# EAGLE design slush_cap_board_rev_c (EAGLE 8.5.0)
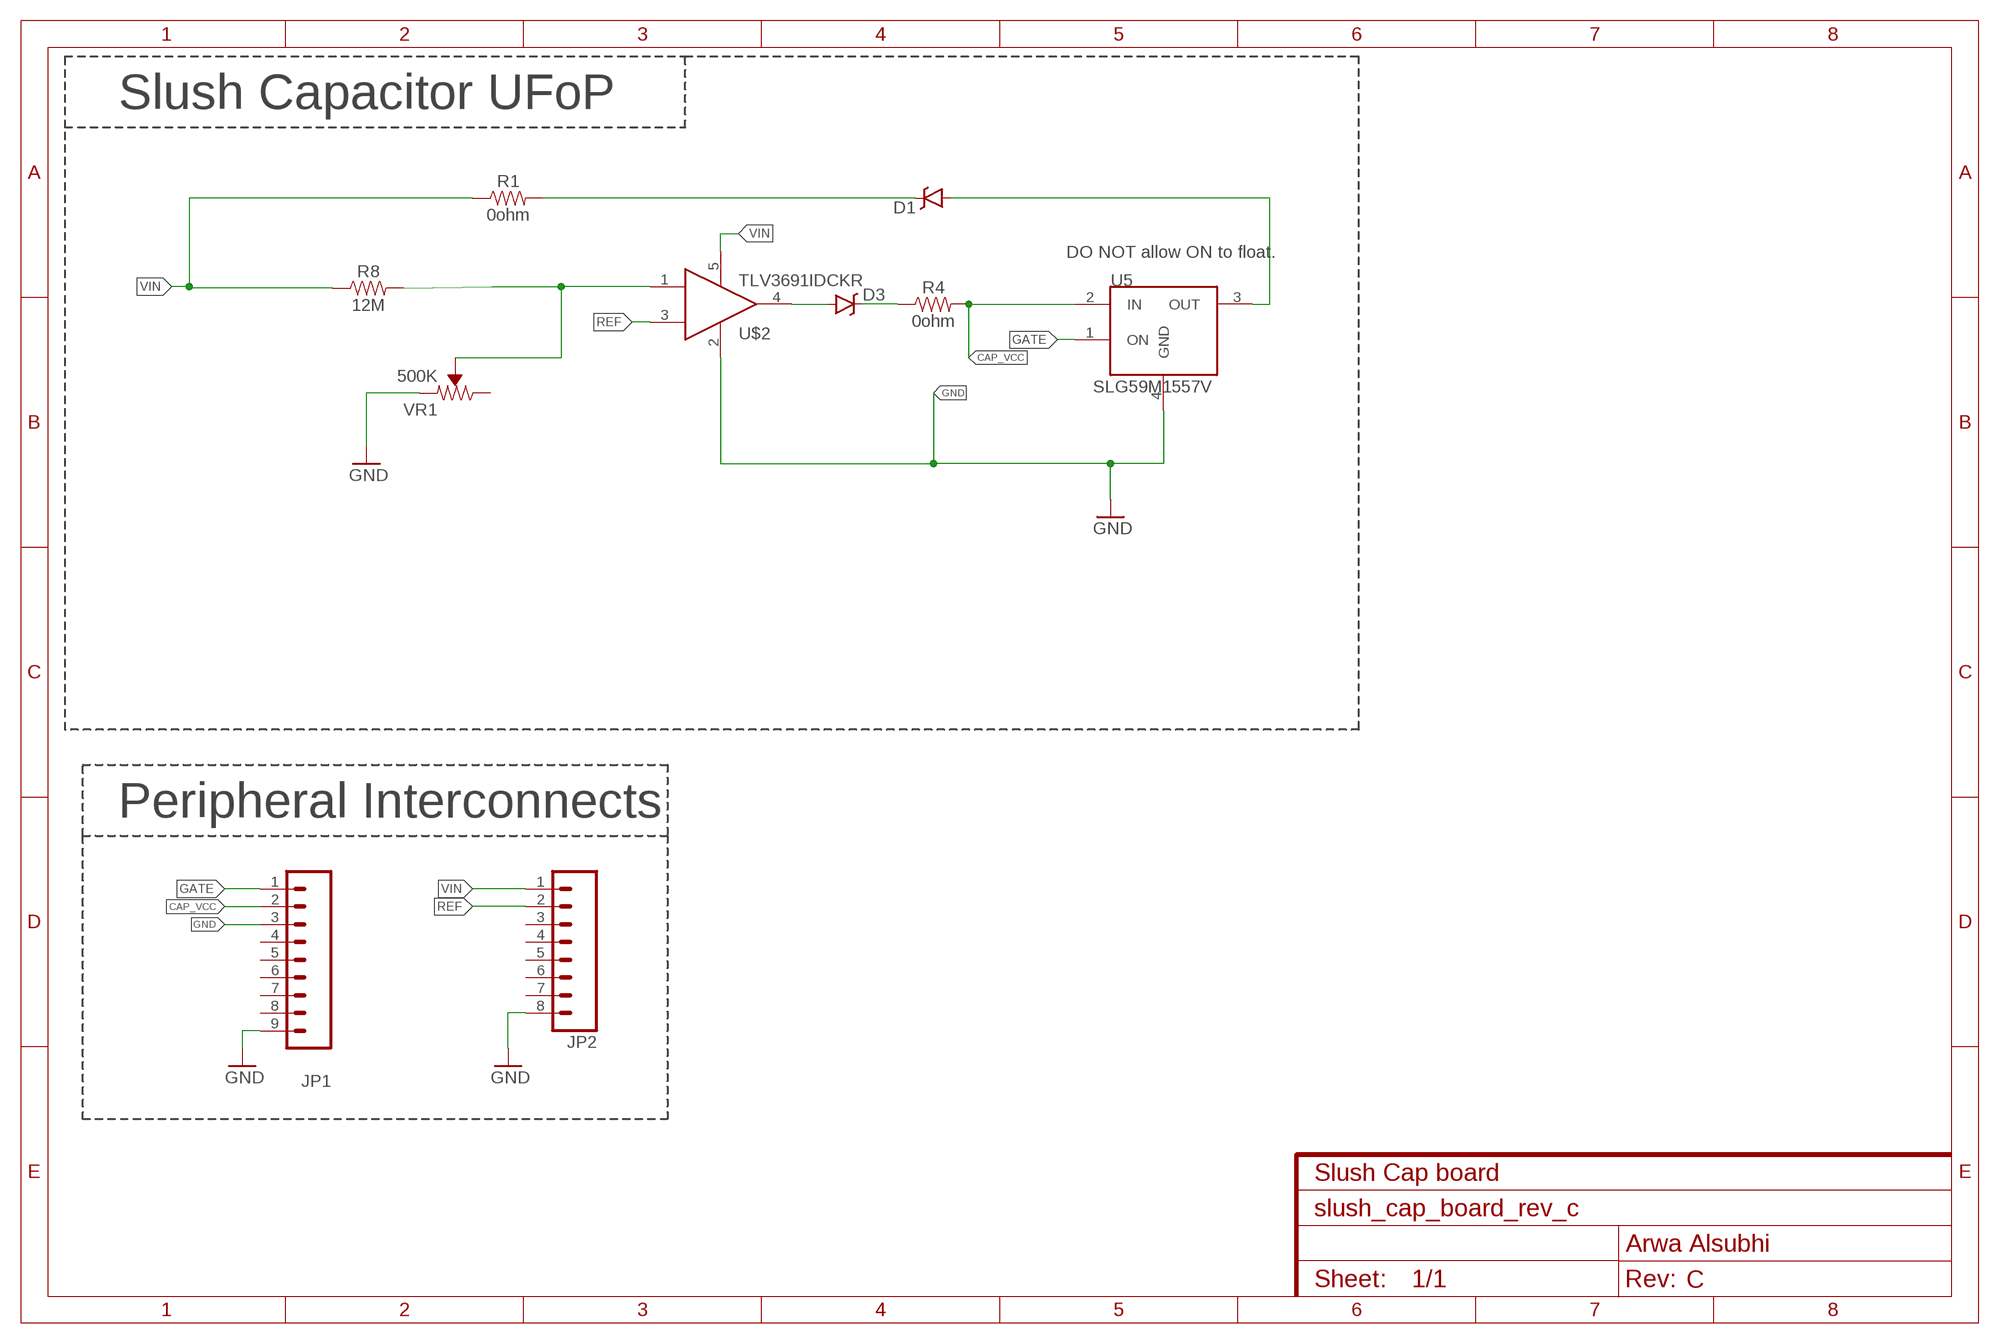
[diagram p0: schematic, sheet 1]
FRAME2 (FRAME-A4L): CNAME: Slush Cap board; CREVISION: C; DESIGNER: Arwa Alsubhi

## Parts
D1  RB751  DIODE-SCHOTTKY-RB751  [SOD-523]
D3  RB751  DIODE-SCHOTTKY-RB751  [SOD-523]
JP1  M091.27MM  [1X09-1.27MM]
JP2  M081.27MM  [1X08-1.27MM]
R1  0ohm  0603-RESISTOR-0603-1/10W-1%  [0603]
R4  0ohm  0603-RESISTOR-0603-1/10W-1%  [0603]
R8  12M  0.3OHM-0805-1/8W-1%  [0805]
U5  SLG59M1557V  [4STDFN]
U$2  TLV3691IDCKR  [SOT353]
VR1  500K  TRIMPOT-SMD-3MM-CLOSED-1/8W-20%  [TRIMPOT-SMD-3MM-CLOSED]

## Nets
CAP_VCC: JP1.2 R4.2 U5.2(IN)
GATE: JP1.1 U5.1(ON)
GND: JP1.3 JP1.9 JP2.8 U5.4(GND) U$2.2 VR1.1(CCW)
N$1: D3.A U$2.4
N$3: D1.A U5.3(OUT)
N$4: R8.2 U$2.1 VR1.2(WIPER)
N$6: D1.C R1.2
N$7: D3.C R4.1
REF: JP2.2 U$2.3
VIN: JP2.1 R1.1 R8.1 U$2.5
Unconnected: JP1.4 JP1.5 JP1.6 JP1.7 JP1.8 JP2.3 JP2.4 JP2.5 JP2.6 JP2.7 VR1.3(CW)

## Notes on the sheet
- Slush Capacitor UFoP
- DO NOT allow ON to float.
- Peripheral Interconnects

## Library data of the parts
D1 D3 = SparkFun-DiscreteSemi:DIODE-SCHOTTKY: Schottky diodes in SFE's production catalog BAT20J 1A 23V 0.62Vf RB751 120mA 40V 0.37Vf PMEG4005EJ 0.5A 40V 0.42Vf MBRA140 1A 40V 0.5Vf B340A 3A 40V SMA; DIGIKEY: BAS40-02V-V-G-08GICT-ND; MPN: BAS40-02V-V-G-08; PROD_ID: DIO-11018
JP1 = SparkFun-Connectors:M09: Header 9 Standard 9-pin 0.1" header. Use with straight break away headers (SKU : PRT-00116), right angle break away headers (PRT-00553), swiss pins (PRT-00743), machine pins (PRT-00117), and female headers (PRT-00115).; DIGIKEY: S9014E-09-ND; MANUFACTURERPARTNUMBER: GRPB091VWVN-RC; MPN: GRPB091VWVN-RC
JP2 = SparkFun-Connectors:M08: Header 8 Standard 8-pin 0.1" header. Use with straight break away headers (SKU : PRT-00116), right angle break away headers (PRT-00553), swiss pins (PRT-00743), machine pins (PRT-00117), and female headers (PRT-00115).; DIGIKEY: S9014E-08-ND; MANUFACTURERPARTNUMBER: GRPB081VWVN-RC; MPN: GRPB081VWVN-RC
R1 R4 = Arwa_lib:0603-RESISTOR: resistor A resistor is a passive two-terminal electrical component that implements electrical resistance as a circuit element. Resistors act to reduce current flow, and, at the same time, act to lower voltage levels within circuits. - Wikipedia; PROD_ID: RES-08787
R8 = SparkFun-Resistors:0.3OHM: 0.3Ω resistor A resistor is a passive two-terminal electrical component that implements electrical resistance as a circuit element. Resistors act to reduce current flow, and, at the same time, act to lower voltage levels within circuits. - Wikipedia; PROD_ID: RES-11622; VALUE: 0.3
U5 = loadswitches:SLG59M1557V: SILEGO SLG59M1557V: Ultra-small 28.5 mΩ, 1.0 A Integrated Power Switch with Discharge The SLG59M1557V is designed for load switching applications with ultra low quiescent current (20nA), and low turn on voltage (0.85V). The part comes with one 28.5 mΩ 1.0 A rated P-channel MOSFET controlled by a single ON control pin. The product is packaged in an ultra-small 1.0 x 1.0 mm package.; MANAFACTURER: SLG59M1557V; MOUSER: 402-SLG59M1557V; MPN: SLG59M1557V
U$2 = Arwa_lib:TLV3691IDCKR
VR1 = SparkFun-Resistors:TRIMPOT: Trimming Potentiometer (Trimpot) Three-terminal potentiometers, with an adjustable wiper and two adjustable resistors. A pot can be used to create a configurable voltage divider, or as a variable resistor. "Trimpots" are a subset of potentiometers, usually intended for "set-and-forget" applications. They're often more delicate than standard potentiometers - rated for fewer turns. Variants PTH-KNOB - PTH Trimpot w/ finger-adjustable knob Trimpot 10K with Knob <https://www.sparkfun.com/products/9806> (COM-09806) Datasheet <http://www.sparkfun.com/datasheets/Components/General/TSR-3386.pdf> SMD-3MM-CLOSED-FRAME - SMD 3mm Square Closed-Frame Trimpot Used on e.g. EasyDriver - Stepper Motor Driver <https://www.sparkfun.com/products/12779> Datasheet <http://www.bitechnologies.com/pdfs/22.pdf> (22AR10KTR) SMD-5MM - SMD 5mm Square Closed-Frame Trimpot Used on e.g. IOIO-OTG - V2.2 <https://www.sparkfun.com/products/13613> Datasheet <http://www.vishay.com/docs/51008/ts53.pdf> (TS53YL502MR10) SMD-3MM-1/10W-25% - 3mm Square Open-Frame Trimpot Used on e.g. SparkFun Shapeoko <https://www.sparkfun.com/products/13899> Datasheet <http://www.bourns.com/docs/Product-Datasheets/TC33.pdf> (TC33X-2-103E); PROD_ID: RES-09285; VALUE: 10k

## Board
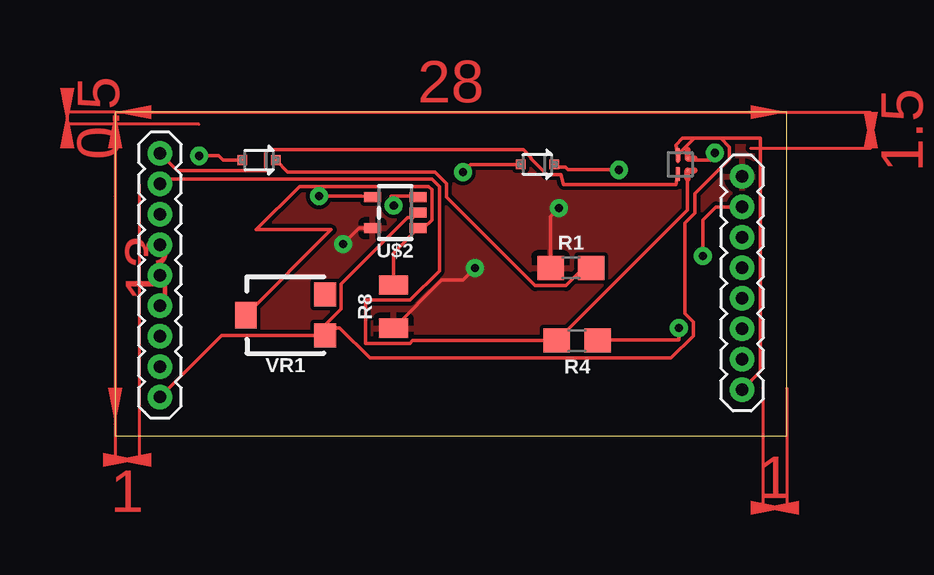
[diagram p1: board, top side]
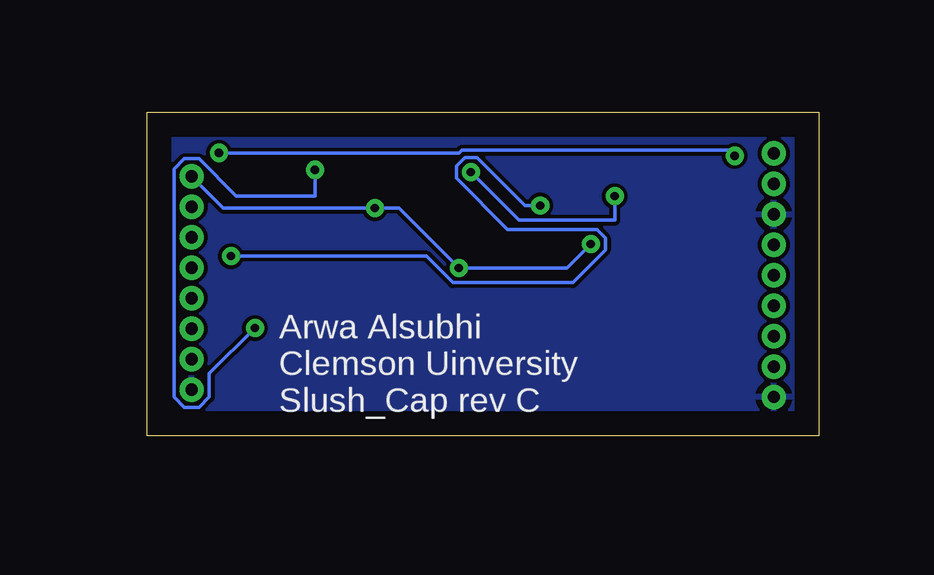
[diagram p2: board, bottom side, seen from below]

Size 28 x 13.5 mm. Coordinates in mm from the lower left corner, seen from the top.
Outline: 0,0 28,0 28,13.5 0,13.5 0,0
Copper layers (1*16): Top 0.035mm / dielectric 1.5mm / Bottom 0.035mm
Design rules "default": minimum track width 6mil, minimum drill 0.35mm, track to track 6mil, track to pad 6mil, pad to pad 6mil, via to via 6mil, smd to smd 6mil, copper to edge 40mil, drill to drill 6mil, minimum pad ring 10mil, minimum via ring 8mil, stop-mask expansion 4mil, vias tented up to drill 0mil, thermal gap 10mil

### Footprints (pad centres in the part's own frame; a part is rotated, then mirrored left to right if it is on the bottom)
SOD-523 = smd 0.4 x 0.4: A -0.7,0; C 0.7,0
1X09-1.27MM = drill 0.508 pad 1: 1 0,0; 2 1.27,0; 3 2.54,0; 4 3.81,0; 5 5.08,0; 6 6.35,0; 7 7.62,0; 8 8.89,0; 9 10.16,0
1X08-1.27MM = drill 0.508 pad 1: 1 0,0; 2 1.27,0; 3 2.54,0; 4 3.81,0; 5 5.08,0; 6 6.35,0; 7 7.62,0; 8 8.89,0
0603 = smd 1.1 x 1: 1 -0.85,0; 2 0.85,0
0805 = smd 0.8 x 1.2: 1 -0.9,0; 2 0.9,0
4STDFN = smd 0.6 x 0.2: 1 -0.4,0.1; 4 0.4,0.1 | smd 0.152 x 0.152: 2 -0.25,-0.3; 3 0.25,-0.3
SOT353 = smd 0.42 x 0.7: 1 -0.65,-0.95; 2 0,-0.95; 3 0.65,-0.95; 4 0.65,0.95; 5 -0.65,0.95
TRIMPOT-SMD-3MM-CLOSED = smd 1 x 0.9: 1 -0.85,-1.65; 3 0.85,-1.65 | smd 1.1 x 0.9: 2 0,1.65

### Placement (x,y rotation side)
D1  6,11.5 0 top
D3  17.6,11.32 0 top
JP1  1.87,11.78 270 top
JP2  26.14,10.82 270 top
R1  19,7 0 top
R4  19.26,3.97 180 top
R8  11.6,5.39 90 top
U5  23.56,11.32 90 top
U$2  11.68,9.31 90 top
VR1  7.1,5.04 90 top

### Tracks (layer width: path | path; a pad name or v marks a point on that pad's centre or on a via)
CAP_VCC
  Top 0.152: JP1.2 2.09,10.51 2.29,10.7 13.2,10.7 13.51,10.39 13.51,6.88 12.29,5.66 10.43,5.66 10.43,3.86 12.29,3.86 12.4,3.97 R4.2 23.86,9.42 U5.2
GATE
  Top 0.152: U5.1 23.38,10.49 18.69,10.49 18.59,10.89 18,10.89 17.33,11.57 17.33,11.62 17.02,11.93 6.41,11.93 6.27,11.79 6.27,11.07 2.58,11.07 JP1.1
GND
  Top 0.152: JP1.9 4.44,4.19 VR1.1 8.75,4.5 | U$2.2 12.42,9.1 12.19,9.1 9.43,6.34 9.43,5.29 8.75,4.62 8.75,4.5 | 26.14,2.16 JP2.8 26.91,2.7 26.91,12.41 23.65,12.41 23.37,12.13 U5.4 23.46,11.45 23.5,11.49 23.5,11.77 24.14,12.41 25.25,12.41 25.61,12.05 25.61,11.55 24.16,10.11 24.16,9.29 23.75,8.88 23.75,5.11 24.11,4.75 24.11,4.18 23.17,3.24 10.62,3.24 9.36,4.5 8.75,4.5
  pour Bottom: 0,14 28,14 28,0 0,0
N$1  (via drill 0.35)
  Top 0.152: D3.A 14.82,11.32 v14.5,11 | v8.5,10 10.27,10 U$2.4
  Bottom 0.152: v14.5,11 12.5,9 8.5,9 v8.5,10
N$3  (via drill 0.35)
  Top 0.152: U5.3 23.93,11.5 25,11.5 v25,11.8 | D1.A 4.5,11.5 4.32,11.68 v3.5,11.68
  Bottom 0.152: v25,11.8 14.99,11.8 14.88,11.91 3.59,11.91 3.5,12 v3.5,11.68
N$4
  Top 0.152: VR1.2 9.01,8.6 5.88,8.6 7.68,10.4 13.07,10.4 13.21,10.27 13.21,9.01 12.86,8.66 U$2.1 11.6,7.63 R8.2
N$6
  Top 0.152: D1.C 7.19,11.01 13.33,11.01 13.82,10.52 13.82,9.96 17.5,6.27 18.8,6.27 19.52,7 R1.2
N$7  (via drill 0.35)
  Top 0.152: R4.1 20.14,4 23.5,4 v23.5,4.5 | D3.C 18.4,11.22 18.76,11.22 18.89,11.1 v21,11.1
  Bottom 0.152: v23.5,4.5 25.4,2.6 25.4,1.62 25.84,1.19 26.45,1.19 26.88,1.62 26.88,11.12 26.45,11.56 25.84,11.56 24.28,10 21,10 v21,11.1
REF  (via drill 0.35)
  Top 0.152: 12.9,9.96 U$2.3 12.59,10 11.5,10 11.5,9.72 v11.61,9.61 | JP2.2 25.05,9.55 24.5,9 v24.5,7.5
  Bottom 0.152: v11.61,9.61 12.25,9.61 14.25,11.61 14.75,11.61 15.11,11.25 15.11,10.75 12.96,8.61 9.25,8.61 8.89,8.25 8.89,7.75 10.25,6.39 15.25,6.39 16.36,7.5 v24.5,7.5
VIN  (via drill 0.35)
  Top 0.152: R8.1 13.61,6.5 14.5,6.5 v15,7 | v18.5,9.5 18.15,9.15 R1.1 | U$2.5 10.16,8.66 v9.5,8
  Bottom 0.152: v9.5,8 10.5,7 v15,7 17.5,9.5 v18.5,9.5 24.82,9.5 JP2.1
  pour Top: 0,14 28,14 28,-0.5 0,-0.5
(copper drawn outside any net)
  shapes: Top area x6

### Text on the board
bNames: Arwa Alsubhi / Clemson Uinversity / Slush_Cap rev C